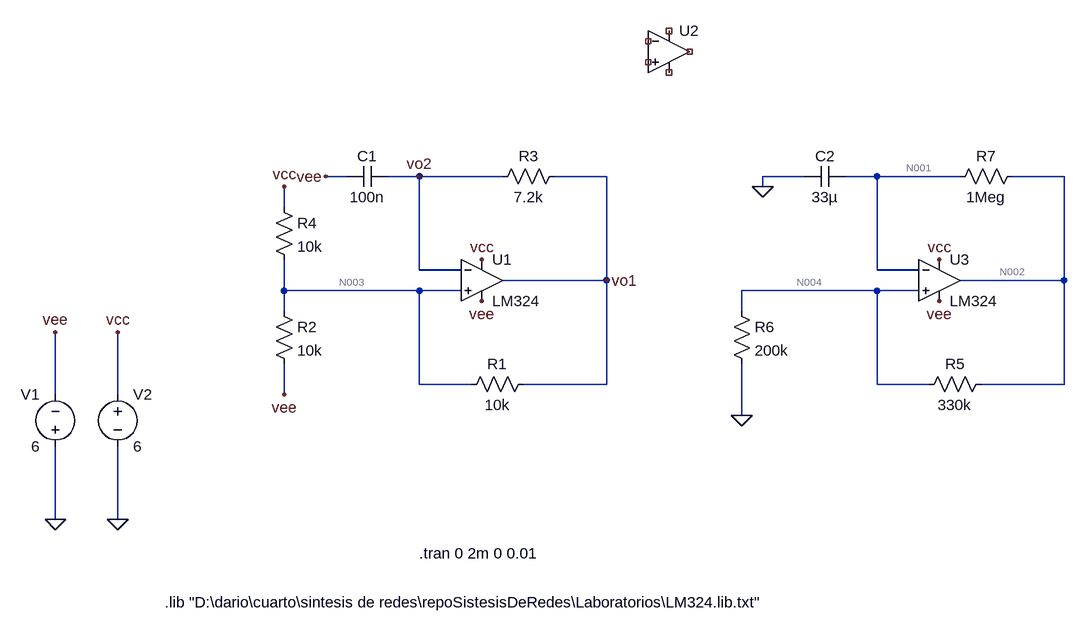
[diagram p0: schematic oscilador_de_relajacion.asc]
oscilador_de_relajacion.asc, the LTspice schematic file:
Version 4
SHEET 1 1160 680
WIRE 16 -288 -16 -288
WIRE 128 -288 80 -288
WIRE 256 -288 128 -288
WIRE 416 -288 336 -288
WIRE 720 -288 656 -288
WIRE 832 -288 784 -288
WIRE 960 -288 832 -288
WIRE 1120 -288 1040 -288
WIRE 656 -272 656 -288
WIRE -80 -240 -80 -272
WIRE 128 -144 128 -288
WIRE 192 -144 128 -144
WIRE 832 -144 832 -288
WIRE 896 -144 832 -144
WIRE 416 -128 416 -288
WIRE 416 -128 256 -128
WIRE 1120 -128 1120 -288
WIRE 1120 -128 960 -128
WIRE -80 -112 -80 -160
WIRE 128 -112 -80 -112
WIRE 192 -112 128 -112
WIRE 832 -112 624 -112
WIRE 896 -112 832 -112
WIRE -80 -80 -80 -112
WIRE 624 -80 624 -112
WIRE 128 32 128 -112
WIRE 208 32 128 32
WIRE 416 32 416 -128
WIRE 416 32 288 32
WIRE 832 32 832 -112
WIRE 912 32 832 32
WIRE 1120 32 1120 -128
WIRE 1120 32 992 32
WIRE -432 48 -432 -48
WIRE -336 48 -336 -48
WIRE -80 48 -80 0
WIRE 624 80 624 0
WIRE -432 240 -432 128
WIRE -336 240 -336 128
FLAG 416 -128 vo1
FLAG 128 -288 vo2
FLAG -336 240 0
FLAG -432 240 0
FLAG -336 -48 vcc
FLAG -432 -48 vee
FLAG 224 -160 vcc
FLAG 224 -96 vee
FLAG -16 -288 vee
FLAG -80 48 vee
FLAG -80 -272 vcc
FLAG 928 -160 vcc
FLAG 928 -96 vee
FLAG 624 80 0
FLAG 656 -272 0
SYMBOL Opamps\\UniversalOpamp2 512 -480 R0
SYMATTR InstName U2
SYMBOL voltage -432 144 R180
WINDOW 0 24 96 Left 2
WINDOW 3 24 16 Left 2
WINDOW 123 0 0 Left 0
WINDOW 39 0 0 Left 0
SYMATTR InstName V1
SYMATTR Value 6
SYMBOL voltage -336 32 R0
WINDOW 123 0 0 Left 0
WINDOW 39 0 0 Left 0
SYMATTR InstName V2
SYMATTR Value 6
SYMBOL res 304 16 R90
WINDOW 0 0 56 VBottom 2
WINDOW 3 32 56 VTop 2
SYMATTR InstName R1
SYMATTR Value 10k
SYMBOL res -96 -96 R0
SYMATTR InstName R2
SYMATTR Value 10k
SYMBOL res 352 -304 R90
WINDOW 0 0 56 VBottom 2
WINDOW 3 32 56 VTop 2
SYMATTR InstName R3
SYMATTR Value 7.2k
SYMBOL res -96 -256 R0
SYMATTR InstName R4
SYMATTR Value 10k
SYMBOL cap 80 -304 R90
WINDOW 0 0 32 VBottom 2
WINDOW 3 32 32 VTop 2
SYMATTR InstName C1
SYMATTR Value 100n
SYMBOL Opamps\\opamp2 224 -192 R0
SYMATTR InstName U1
SYMATTR Value LM324
SYMBOL res 1008 16 R90
WINDOW 0 0 56 VBottom 2
WINDOW 3 32 56 VTop 2
SYMATTR InstName R5
SYMATTR Value 330k
SYMBOL res 608 -96 R0
SYMATTR InstName R6
SYMATTR Value 200k
SYMBOL res 1056 -304 R90
WINDOW 0 0 56 VBottom 2
WINDOW 3 32 56 VTop 2
SYMATTR InstName R7
SYMATTR Value 1Meg
SYMBOL cap 784 -304 R90
WINDOW 0 0 32 VBottom 2
WINDOW 3 32 32 VTop 2
SYMATTR InstName C2
SYMATTR Value 33µ
SYMBOL Opamps\\opamp2 928 -192 R0
SYMATTR InstName U3
SYMATTR Value LM324
TEXT -264 368 Left 2 !.lib "D:\\dario\\cuarto\\sintesis de redes\\repoSistesisDeRedes\\Laboratorios\\LM324.lib.txt"
TEXT 128 292 Left 2 !.tran 0 2m 0 0.01

The netlist it stands for:
* oscilador_de_relajacion.asc
XU2 NC_01 NC_02 NC_03 NC_04 NC_05 level.2 Avol=1Meg GBW=10Meg Slew=10Meg ilimit=25m rail=0 Vos=0 phimargin=45 en=0 enk=0 in=0 ink=0 Rin=500Meg  ; pins IN+ IN- V+ V- OUT
V1 0 vee 6
V2 vcc 0 6
R1 vo1 N003 10k
R2 N003 vee 10k
R3 vo1 vo2 7.2k
R4 vcc N003 10k
C1 vo2 vee 100n
XU1 N003 vo2 vcc vee vo1 LM324  ; pins In+ In- V+ V- OUT
R5 N002 N004 330k
R6 N004 0 200k
R7 N002 N001 1Meg
C2 N001 0 33µ
XU3 N004 N001 vcc vee N002 LM324  ; pins In+ In- V+ V- OUT
.lib "D:\dario\cuarto\sintesis de redes\repoSistesisDeRedes\Laboratorios\LM324.lib.txt"
.tran 0 2m 0 0.01
.lib UniversalOpamps2.sub
.backanno
.end

* Results of the author's LTspice run, read from the files saved beside the schematic
* Operating Point, zero values left out:
*   V(vee) = -6 V
*   V(vcc) = 6 V
*   V(vo1) = -166.2 µV
*   V(n003) = 11.01 µV
*   V(vo2) = -22.65 µV
*   V(n002) = -28.1 mV
*   V(n004) = -8.122 mV
*   V(n001) = -8.155 mV
*   I(R7) = -19.94 nA
*   I(R6) = -40.61 nA
*   I(R5) = -60.54 nA
*   I(R4) = 600 µA
*   I(R3) = -19.94 nA
*   I(R2) = 600 µA
*   I(R1) = -17.72 nA
*   I(V2) = -1.412 mA
*   I(V1) = -1.412 mA
*   Ix(u1:1) = -19.93 nA
*   Ix(u1:2) = -19.94 nA
*   Ix(u1:3) = 405.9 µA
*   Ix(u1:4) = -405.9 µA
*   Ix(u1:5) = 37.67 nA
*   Ix(u3:1) = -19.93 nA
*   Ix(u3:2) = -19.94 nA
*   Ix(u3:3) = 405.9 µA
*   Ix(u3:4) = -405.9 µA
*   Ix(u3:5) = 80.48 nA